# EAGLE schematic 18650_pack_v1 (EAGLE 9.6.2)
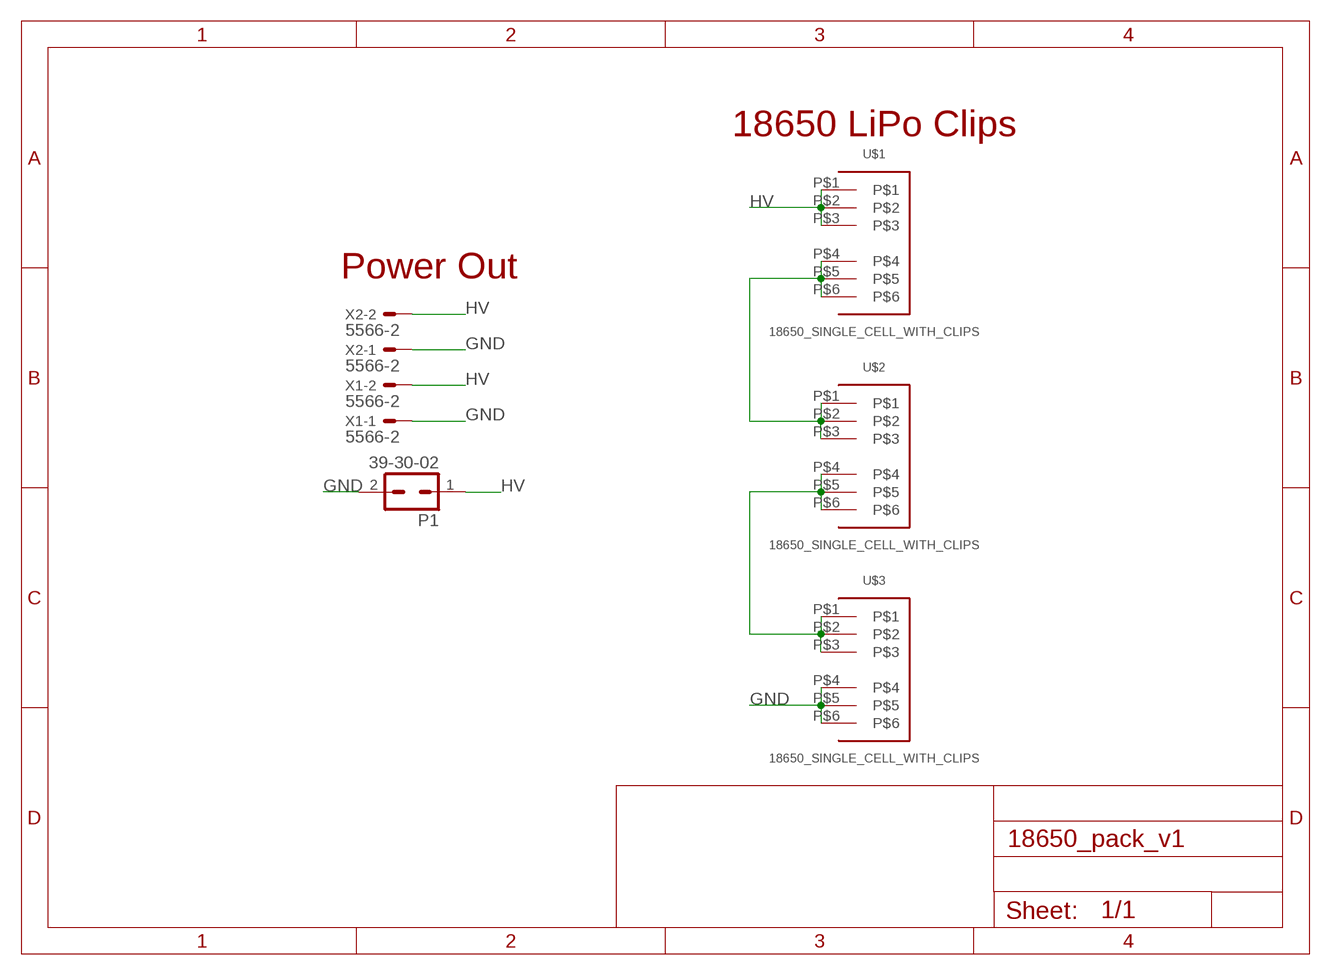
[diagram p0: schematic, sheet 1]

## Parts
P1  39-30-02  [39-30-?02?]
U$1  18650_SINGLE_CELL_WITH_CLIPS  [3PINBATTERY_CLIP_1_CELL_18650]
U$2  18650_SINGLE_CELL_WITH_CLIPS  [3PINBATTERY_CLIP_1_CELL_18650]
U$3  18650_SINGLE_CELL_WITH_CLIPS  [3PINBATTERY_CLIP_1_CELL_18650]
X1  5566-2  [5566-2]
X2  5566-2  [5566-2]

## Nets
GND: P1.2 U$3.P$4 U$3.P$5 U$3.P$6 X1.1 X2.1
HV: P1.1 U$1.P$1 U$1.P$2 U$1.P$3 X1.2 X2.2
N$1: U$1.P$4 U$1.P$5 U$1.P$6 U$2.P$1 U$2.P$2 U$2.P$3
N$2: U$2.P$4 U$2.P$5 U$2.P$6 U$3.P$1 U$3.P$2 U$3.P$3

## Notes on the sheet
- 18650 LiPo Clips
- Power Out

## Library data of the parts
P1 = con-molex-mini-fit:39-30-?02?: HEADER
U$1-U$3 = nathans-custom-parts:18650_SINGLE_CELL_WITH_CLIPS
X1 X2 = con-molex:5566-2: Mini FIT connector 2 pol Source: http://www.molex.com; MF: MOLEX; OC_FARNELL: 1822072; OC_NEWARK: unknown